# Altium project FIT_PM12.PrjPcb (part 7 of 13)

## Sheet THS788_2.SchDoc: FIT_PM12 board
size 420 x 297 mm; CheckedBy: G.Kasprowicz; Author: INR Moscow; CompanyName: WUT ISE; DrawnBy: M.Podgórski; Organization: WUT ISE; Address1: PW ISE; Address2: Nowowiejska 15/19 00-665 Warsaw; Address3: gkasprow@gmail.com; DocumentNumber: 23; Revision: 2; SheetNumber: 34; SheetTotal: 34; ModifiedBy: -; CheckedDate: -; Title2: TDC2; DivGrp: WUT ISE; Designer: INR RAS; ModifiedDate: -; ProjectName: Sensor Box
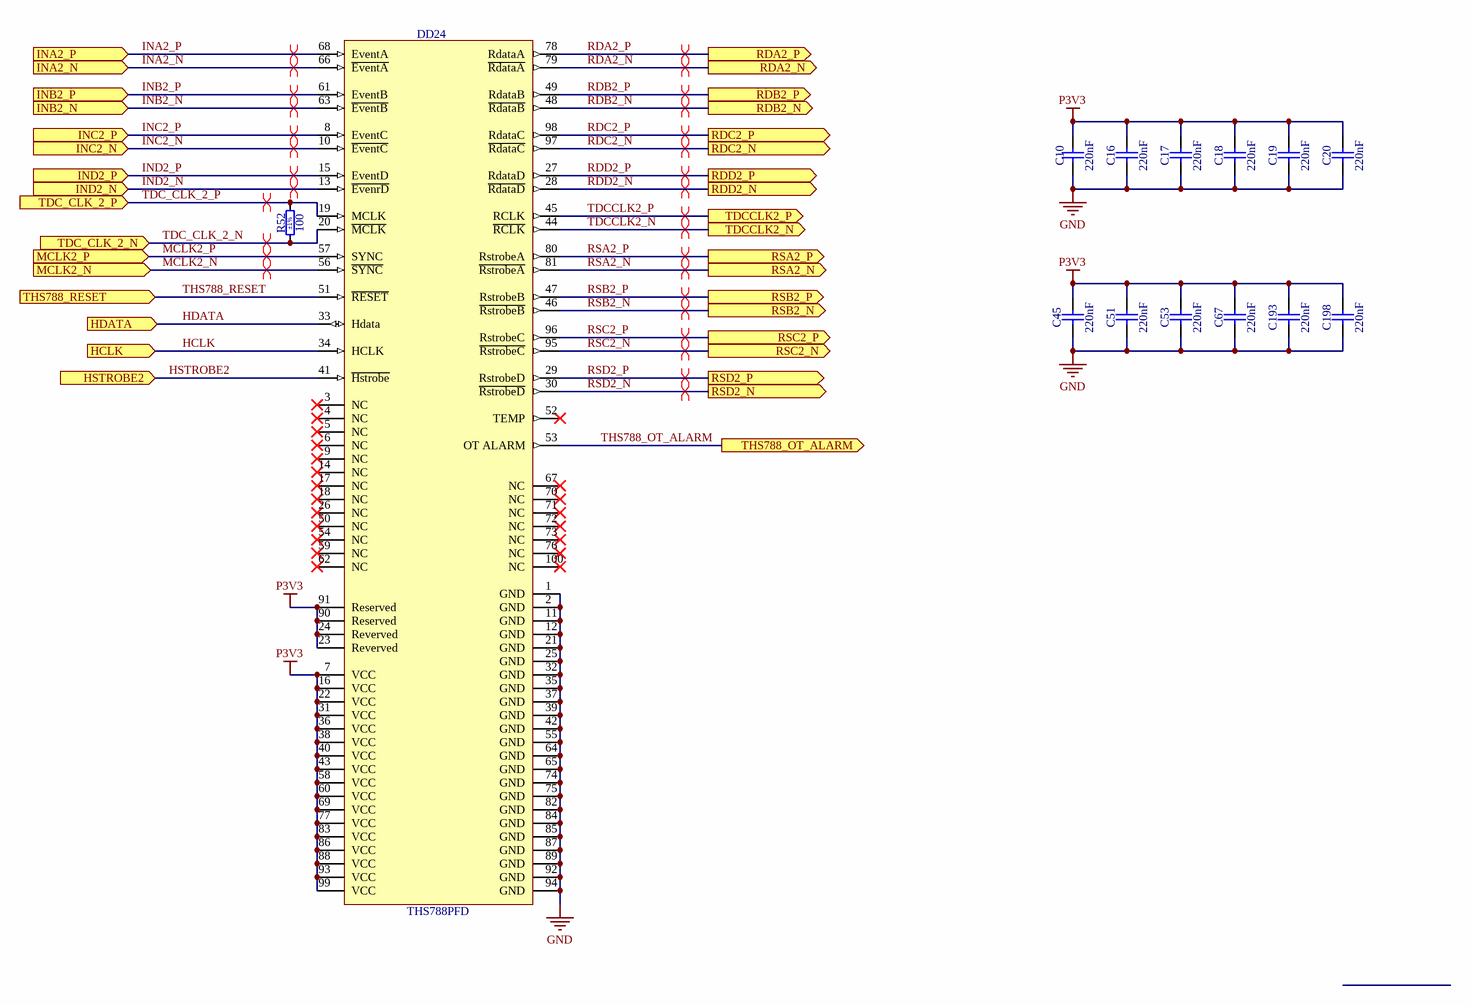
[diagram p21: THS788_2.SchDoc]

### Parts
C10  220nF  [CAPC2012X135N]
C16  220nF  [CAPC2012X135N]
C17  220nF  [CAPC2012X135N]
C18  220nF  [CAPC2012X135N]
C19  220nF  [CAPC2012X135N]
C20  220nF  [CAPC2012X135N]
C45  220nF  [CAPC2012X135N]
C51  220nF  [CAPC2012X135N]
C53  220nF  [CAPC2012X135N]
C67  220nF  [CAPC2012X135N]
C193  220nF  [CAPC2012X135N]
C198  220nF  [CAPC2012X135N]
DD24  THS788PFD  [TEXAS_PFD (S-PQFP-G100)]
R52  100  Tolerance: ±1%  [RESC1608X55N]

### Ports
HCLK (in), HDATA (in), HSTROBE2 (in), INA2_N (in), INA2_P (in), INB2_N (in), INB2_P (in), INC2_N (in), INC2_P (in), IND2_N (in), IND2_P (in), MCLK2_N (in), MCLK2_P (in), RDA2_N (out), RDA2_P (out), RDB2_N (out), RDB2_P (out), RDC2_N (out), RDC2_P (out), RDD2_N (out), RDD2_P (out), RSA2_N (out), RSA2_P (out), RSB2_N (out), RSB2_P (out), RSC2_N (out), RSC2_P (out), RSD2_N (out), RSD2_P (out), TDC_CLK_2_N (in), TDC_CLK_2_P (in), TDCCLK2_N (out), TDCCLK2_P (out), THS788_OT_ALARM (out), THS788_RESET (in)

### Nets
GND: C10.1 C16.1 C17.1 C18.1 C19.1 C20.1 C45.1 C51.1 C53.1 C67.1 C193.1 C198.1 DD24.1(GND) DD24.2(GND) DD24.11(GND) DD24.12(GND) DD24.21(GND) DD24.25(GND) DD24.32(GND) DD24.35(GND) DD24.37(GND) DD24.39(GND) DD24.42(GND) DD24.55(GND) DD24.64(GND) DD24.65(GND) DD24.74(GND) DD24.75(GND) DD24.82(GND) DD24.84(GND) DD24.85(GND) DD24.87(GND) DD24.89(GND) DD24.92(GND) DD24.94(GND)
P3V3: C10.2 C16.2 C17.2 C18.2 C19.2 C20.2 C45.2 C51.2 C53.2 C67.2 C193.2 C198.2 DD24.7(VCC) DD24.16(VCC) DD24.22(VCC) DD24.23(Reverved) DD24.24(Reverved) DD24.31(VCC) DD24.36(VCC) DD24.38(VCC) DD24.40(VCC) DD24.43(VCC) DD24.58(VCC) DD24.60(VCC) DD24.69(VCC) DD24.77(VCC) DD24.83(VCC) DD24.86(VCC) DD24.88(VCC) DD24.90(Reserved) DD24.91(Reserved) DD24.93(VCC) DD24.99(VCC)
HCLK: DD24.34(HCLK) ; port HCLK
HDATA: DD24.33(Hdata) ; port HDATA
HSTROBE2: DD24.41(~{Hstrobe}) ; port HSTROBE2
INA2_N: DD24.66(~{EventA}) ; port INA2_N  [project net Event_N]
INA2_P: DD24.68(EventA) ; port INA2_P  [project net Event_P]
INB2_N: DD24.63(~{EventB}) ; port INB2_N  [project net Event_N]
INB2_P: DD24.61(EventB) ; port INB2_P  [project net Event_P]
INC2_N: DD24.10(~{EventC}) ; port INC2_N  [project net Event_N]
INC2_P: DD24.8(EventC) ; port INC2_P  [project net Event_P]
IND2_N: DD24.13(~{EvenrD}) ; port IND2_N  [project net Event_N]
IND2_P: DD24.15(EventD) ; port IND2_P  [project net Event_P]
MCLK2_N: DD24.56(~{SYNC}) ; port MCLK2_N
MCLK2_P: DD24.57(SYNC) ; port MCLK2_P
RDA2_N: DD24.79(~{RdataA}) ; port RDA2_N
RDA2_P: DD24.78(RdataA) ; port RDA2_P
RDB2_N: DD24.48(~{RdataB}) ; port RDB2_N
RDB2_P: DD24.49(RdataB) ; port RDB2_P
RDC2_N: DD24.97(~{RdataC}) ; port RDC2_N
RDC2_P: DD24.98(RdataC) ; port RDC2_P
RDD2_N: DD24.28(~{RdataD}) ; port RDD2_N
RDD2_P: DD24.27(RdataD) ; port RDD2_P
RSA2_N: DD24.81(~{RstrobeA}) ; port RSA2_N
RSA2_P: DD24.80(RstrobeA) ; port RSA2_P
RSB2_N: DD24.46(~{RstrobeB}) ; port RSB2_N
RSB2_P: DD24.47(RstrobeB) ; port RSB2_P
RSC2_N: DD24.95(~{RstrobeC}) ; port RSC2_N
RSC2_P: DD24.96(RstrobeC) ; port RSC2_P
RSD2_N: DD24.30(~{RstrobeD}) ; port RSD2_N
RSD2_P: DD24.29(RstrobeD) ; port RSD2_P
TDC_CLK_2_N: DD24.20(~{MCLK}) R52.1 ; port TDC_CLK_2_N
TDC_CLK_2_P: DD24.19(MCLK) R52.2 ; port TDC_CLK_2_P
TDCCLK2_N: DD24.44(~{RCLK}) ; port TDCCLK2_N
TDCCLK2_P: DD24.45(RCLK) ; port TDCCLK2_P
THS788_OT_ALARM: DD24.53(OT_ALARM) ; port THS788_OT_ALARM
THS788_RESET: DD24.51(~{RESET}) ; port THS788_RESET

Not connected (* = marked no-connect by the designer): DD24 3(NC)* 4(NC)* 5(NC)* 6(NC)* 9(NC)* 14(NC)* 17(NC)* 18(NC)* 26(NC)* 50(NC)* 52(TEMP)* 54(NC)* 59(NC)* 62(NC)* 67(NC)* 70(NC)* 71(NC)* 72(NC)* 73(NC)* 76(NC)* 100(NC)*

### Layout directives
differential pair: Event_N, Event_P, MCLK2_N, MCLK2_P, RDA2_N, RDA2_P, RDB2_N, RDB2_P, RDC2_N, RDC2_P, RDD2_N, RDD2_P, RSA2_N, RSA2_P, RSB2_N, RSB2_P, RSC2_N, RSC2_P, RSD2_N, RSD2_P, TDC_CLK_2_N, TDC_CLK_2_P, TDCCLK2_N, TDCCLK2_P

### Notes on the sheet
- Project/Equipment
- Document
- Designer
- Drawn by
- Check.by
- Copyright WUT ISE 2024.
  This documentation describes Open Hardware and is licensed under the CERN OHL v.2. You may redistribute and modify this documentation under the terms of the CERN OHL v.2. (http://ohwr.org/CERNOHL). This documentation is distributed WITHOUT ANY EXPRESS OR IMPLIED WARRANTY, INCLUDING OF MERCHANTABILITY, SATISFACTORY QUALITY AND FITNESS FOR A PARTICULAR PURPOSE. Please see the CERN OHL v.2 for applicable conditions.
- Contact
- File
- Last Mod.
- Print Date
- Sheet
- Size
- A3
- of
- Rev

### Library data of the parts
C10 C16-C20 C45 C51 C53 C67 C193 C198 = CC0805_220NF_50V_10%_X7R: as C21 on sheet THS788_1; Part Number: CC0805_220NF_50V_10%_X7R; Component Kind: Standard; Component Type: Standard; Pin Count: 2; Value: 220nF; Status: Preferred; Manufacturer Part Number: CC0805_220NF_50V_10%_X7R; Case: 0805; Mounted: Yes; Socket: No; SMD: Yes; Sense: No; Manufacturer1 Example: MURATA; Manufacturer1 ComponentHeight: 1.35mm; HelpURL: \\cern.ch\dfs\Applications\Altium\Datasheets\CC0805_X7R_MURATA.pdf; Author: CERN DEM JLC; CreateDate: 03.12.2007; LatestRevisionDate: 03.12.2007
DD24 = THS788PFD: as DD4 on sheet THS788_1; Part Number: THS788PFD; Component Kind: Standard; Component Type: Standard; Device: THS788PFD; Footprint: TEXAS_2PFD (S-PQFP-G100); PackageDescription: QFP, 0.50mm Pitch, Square; 100 Pin, 14.0mm L X 14.0mm W X 1.20mm H body (w/Thermal Tab 6.0 X 6.0mm), IPC Medium Density; Status: Not Recommended; Part Description: Quad-Channel Time Measurement Unit (TMU); Manufacturer Part Number: THS788PFD; Pin Count: 101; Case: QFP100; Mounted: Yes; Socket: No; SMD: Yes; Sense: No; ComponentHeight: 1.2mm; Author: CERN DEM HF; HelpURL: \\cern.ch\dfs\Applications\Altium\Datasheets\THS788.pdf; CreateDate: 10.06.2024; LatestRevisionDate: 10.06.2024
R52 = R0603_100R_1%_0.1W_100PPM: as R32 on sheet THS788_1; Part Number: R0603_100R_1%_0.1W_100PPM; Component Kind: Standard; Component Type: Standard; Pin Count: 2; Value: 100; Status: Preferred; Manufacturer Part Number: R0603_100R_1%_0.1W_100PPM; Case: 0603; Mounted: Yes; Sense: No; Socket: No; SMD: Yes; Manufacturer1 Example: NIC COMPONENT; Manufacturer1 ComponentHeight: 0.55mm; HelpURL: \\cern.ch\dfs\Applications\Altium\Datasheets\R0603_2NIC_2NRC.pdf; Author: CERN DEM JLC; CreateDate: 03.12.2007; LatestRevisionDate: 13.03.2008

## Sheet FPGA_I_J.SchDoc: FIT_PM12 board
size 420 x 297 mm; CheckedBy: G.Kasprowicz; Author: INR Moscow; CompanyName: WUT ISE; DrawnBy: M.Podgórski; Organization: WUT ISE; Address1: PW ISE; Address2: Nowowiejska 15/19 00-665 Warsaw; Address3: gkasprow@gmail.com; DocumentNumber: 32; Revision: 2; SheetNumber: 32; SheetTotal: 34; ModifiedBy: -; CheckedDate: -; Title2: FPGA JTAG MGTs; DivGrp: WUT ISE; Designer: INR RAS; ModifiedDate: -; ProjectName: Sensor Box
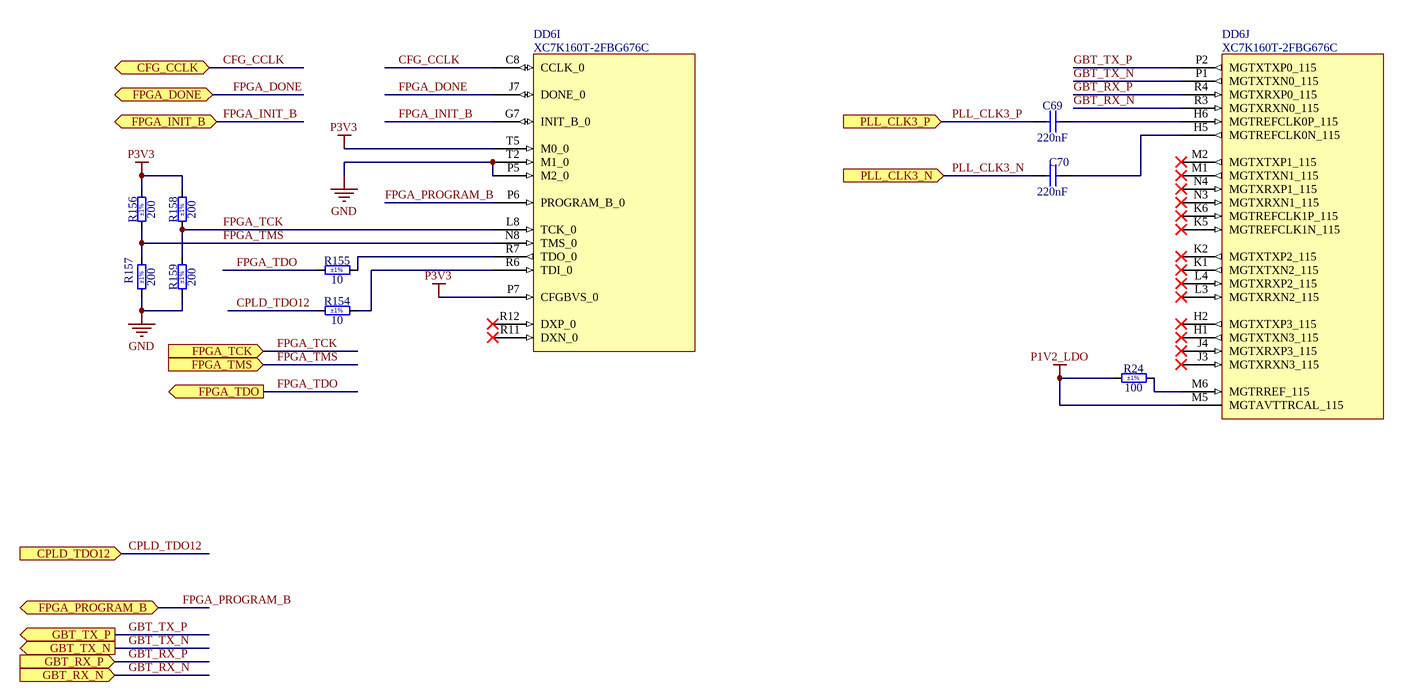
[diagram p22: FPGA_I_J.SchDoc]

### Parts
C69  220nF  [CAPC1608X87N]
C70  220nF  [CAPC1608X87N]
DD6  XC7K160T-2FBG676C  [BGA676C100P26X26_2700X2700X254]  (parts I,J of 15)
R24  100  Tolerance: ±1%  [RESC1608X55N]
R154  10  Tolerance: ±1%  [RESC2012X70N]
R155  10  Tolerance: ±1%  [RESC2012X70N]
R156  200  Tolerance: ±1%  [RESC2012X60N]
R157  200  Tolerance: ±1%  [RESC2012X60N]
R158  200  Tolerance: ±1%  [RESC2012X60N]
R159  200  Tolerance: ±1%  [RESC2012X60N]

### Ports
CFG_CCLK (bidir), CPLD_TDO12 (in), FPGA_DONE (bidir), FPGA_INIT_B (bidir), FPGA_PROGRAM_B (bidir), FPGA_TCK (in), FPGA_TDO (out), FPGA_TMS (in), GBT_RX_N (in), GBT_RX_P (in), GBT_TX_N (out), GBT_TX_P (out), PLL_CLK3_N (in), PLL_CLK3_P (in)

### Nets
GND: DD6.P5(M2_0) DD6.T2(M1_0) R157.1 R159.1
P1V2_LDO: DD6.M5(MGTAVTTRCAL_115) R24.1
P3V3: DD6.P7(CFGBVS_0) DD6.T5(M0_0) R156.2 R158.2
CFG_CCLK: DD6.C8(CCLK_0) ; port CFG_CCLK
CPLD_TDO12: R154.1 ; port CPLD_TDO12  [project net CPLD_TDO]
FPGA_DONE: DD6.J7(DONE_0) ; port FPGA_DONE
FPGA_INIT_B: DD6.G7(INIT_B_0) ; port FPGA_INIT_B
FPGA_PROGRAM_B: DD6.P6(PROGRAM_B_0) ; port FPGA_PROGRAM_B
FPGA_TCK: DD6.L8(TCK_0) R158.1 R159.2 ; port FPGA_TCK
FPGA_TDO: R155.1 ; port FPGA_TDO
FPGA_TMS: DD6.N8(TMS_0) R156.1 R157.2 ; port FPGA_TMS
GBT_RX_N: DD6.R3(MGTXRXN0_115) ; port GBT_RX_N
GBT_RX_P: DD6.R4(MGTXRXP0_115) ; port GBT_RX_P
GBT_TX_N: DD6.P1(MGTXTXN0_115) ; port GBT_TX_N
GBT_TX_P: DD6.P2(MGTXTXP0_115) ; port GBT_TX_P
PLL_CLK3_N: C70.1 ; port PLL_CLK3_N
PLL_CLK3_P: C69.1 ; port PLL_CLK3_P
NetC69_2: C69.2 DD6.H6(MGTREFCLK0P_115)
NetC70_2: C70.2 DD6.H5(MGTREFCLK0N_115)
NetDD6_M6: DD6.M6(MGTRREF_115) R24.2
NetDD6_R6: DD6.R6(TDI_0) R154.2
NetDD6_R7: DD6.R7(TDO_0) R155.2

Not connected (* = marked no-connect by the designer): DD6 H1(MGTXTXN3_115)* H2(MGTXTXP3_115)* J3(MGTXRXN3_115)* J4(MGTXRXP3_115)* K1(MGTXTXN2_115)* K2(MGTXTXP2_115)* K5(MGTREFCLK1N_115)* K6(MGTREFCLK1P_115)* L3(MGTXRXN2_115)* L4(MGTXRXP2_115)* M1(MGTXTXN1_115)* M2(MGTXTXP1_115)* N3(MGTXRXN1_115)* N4(MGTXRXP1_115)* R11(DXN_0)* R12(DXP_0)*

### Notes on the sheet
- Project/Equipment
- Document
- Designer
- Drawn by
- Check.by
- Copyright WUT ISE 2024.
  This documentation describes Open Hardware and is licensed under the CERN OHL v.2. You may redistribute and modify this documentation under the terms of the CERN OHL v.2. (http://ohwr.org/CERNOHL). This documentation is distributed WITHOUT ANY EXPRESS OR IMPLIED WARRANTY, INCLUDING OF MERCHANTABILITY, SATISFACTORY QUALITY AND FITNESS FOR A PARTICULAR PURPOSE. Please see the CERN OHL v.2 for applicable conditions.
- Contact
- File
- Last Mod.
- Print Date
- Sheet
- Size
- A3
- of
- Rev

### Library data of the parts
C69 C70 = CC0603_220NF_25V_10%_X7R: Non-polarised capacitor; Part Description: SMD Multilayer Chip Ceramic Capacitor; Manufacturer: GENERIC; Manufacturer1 Part Number: C0603C224K3RACTU; Voltage: 25V; TC: X7R; Tolerance: ±10%; Part Number: CC0603_220NF_25V_10%_X7R; Component Kind: Standard; Component Type: Standard; Pin Count: 2; Value: 220nF; Status: Preferred; Manufacturer Part Number: CC0603_220NF_25V_10%_X7R; Case: 0603; Mounted: Yes; Socket: No; SMD: Yes; Sense: No; Manufacturer1 Example: KEMET; Manufacturer1 ComponentHeight: 0.87mm; HelpURL: \\cern.ch\dfs\Applications\Altium\Datasheets\CC0603_X7R_KEMET.pdf; Author: CERN DEM JLC; CreateDate: 29.10.2014; LatestRevisionDate: 29.10.2014
DD6 = XC7K160T-2FBG676C: as DD6 on sheet FPGA_H; Part Number: XC7K160T-2FBG676C; Component Kind: Standard; Component Type: Standard; Device: XC7K160T-2FBG676C; PackageDescription: BGA, 1.00mm Pitch, Square; 676 Pin, 26 Columns X 26 Rows, Body 27.0mm X 27.0mm X 2.54mm H, IPC Medium Density; Manufacturer Part Number: XC7K160T-2FBG676C; Pin Count: 676; Case: BGA676; Mounted: Yes; Socket: No; SMD: Yes; Sense: No; ComponentHeight: 2.54mm; HelpURL: \\cern.ch\dfs\Applications\Altium\Datasheets\XC7K160T-xFBG676C.pdf; ComponentLink1URL: \\cern.ch\dfs\Applications\Altium\Datasheets\XC7K160T-xFBG676C_Package-Pinout.pdf; ComponentLink1Description: Package/Pinout; Author: CERN DEM BC; CreateDate: 06.02.2020; LatestRevisionDate: 06.02.2020
R24 = R0603_100R_1%_0.1W_100PPM: as R32 on sheet THS788_1; Part Number: R0603_100R_1%_0.1W_100PPM; Component Kind: Standard; Component Type: Standard; Pin Count: 2; Value: 100; Status: Preferred; Manufacturer Part Number: R0603_100R_1%_0.1W_100PPM; Case: 0603; Mounted: Yes; Sense: No; Socket: No; SMD: Yes; Manufacturer1 Example: NIC COMPONENT; Manufacturer1 ComponentHeight: 0.55mm; HelpURL: \\cern.ch\dfs\Applications\Altium\Datasheets\R0603_NIC_NRC.pdf; Author: CERN DEM JLC; CreateDate: 03.12.2007; LatestRevisionDate: 13.03.2008
R154 R155 = R0805_10R_1%_0.125W_100PPM_PANASONIC_ERJ: Resistor - 1%; Part Description: Low Resistance Thick Film Chip Resistor; Manufacturer Part Number: ERJ6ENF10R0V; Power: 0.125W; TC: ±100ppm/°C; PressFit: No; Part Number: R0805_10R_1%_0.125W_100PPM_PANASONIC_ERJ; Component Kind: Standard; Component Type: Standard; Pin Count: 2; Value: 10; Status: None; Manufacturer: PANASONIC; Case: 0805; Mounted: Yes; Sense: No; Socket: No; SMD: Yes; ComponentHeight: 0.7mm; HelpURL: \\cern.ch\dfs\Applications\Altium\Datasheets\R0805_PANASONIC_ERJ6EN.pdf; Author: CERN DEM HF; CreateDate: 07.06.2024; LatestRevisionDate: 07.06.2024
R156-R159 = R0805_200R_1%_0.125W_100PPM: Resistor - 1%; Part Description: General Purpose Thick Film Chip Resistor; Manufacturer: GENERIC; Manufacturer1 Part Number: NRC10F2000TRF; Power: 0.125W; TC: ±100ppm/°C; PressFit: No; Part Number: R0805_200R_1%_0.125W_100PPM; Component Kind: Standard; Component Type: Standard; Pin Count: 2; Value: 200; Status: Preferred; Manufacturer Part Number: R0805_200R_1%_0.125W_100PPM; Case: 0805; Mounted: Yes; Sense: No; Socket: No; SMD: Yes; Manufacturer1 Example: NIC COMPONENT; Manufacturer1 ComponentHeight: 0.6mm; HelpURL: \\cern.ch\dfs\Applications\Altium\Datasheets\R0805_NIC_NRC.pdf; Author: CERN DEM JLC; CreateDate: 03.12.2007; LatestRevisionDate: 13.03.2008

## Sheet FPGA_E.SchDoc: FIT_PM12 board
size 420 x 297 mm; CheckedBy: G.Kasprowicz; Author: INR Moscow; CompanyName: WUT ISE; DrawnBy: M.Podgórski; Organization: WUT ISE; Address1: PW ISE; Address2: Nowowiejska 15/19 00-665 Warsaw; Address3: gkasprow@gmail.com; DocumentNumber: 27; Revision: 2; SheetNumber: 25; SheetTotal: 34; ModifiedBy: -; CheckedDate: -; Title2: FPGA E LA0,1,2; DivGrp: WUT ISE; Designer: INR RAS; ModifiedDate: -; ProjectName: Sensor Box
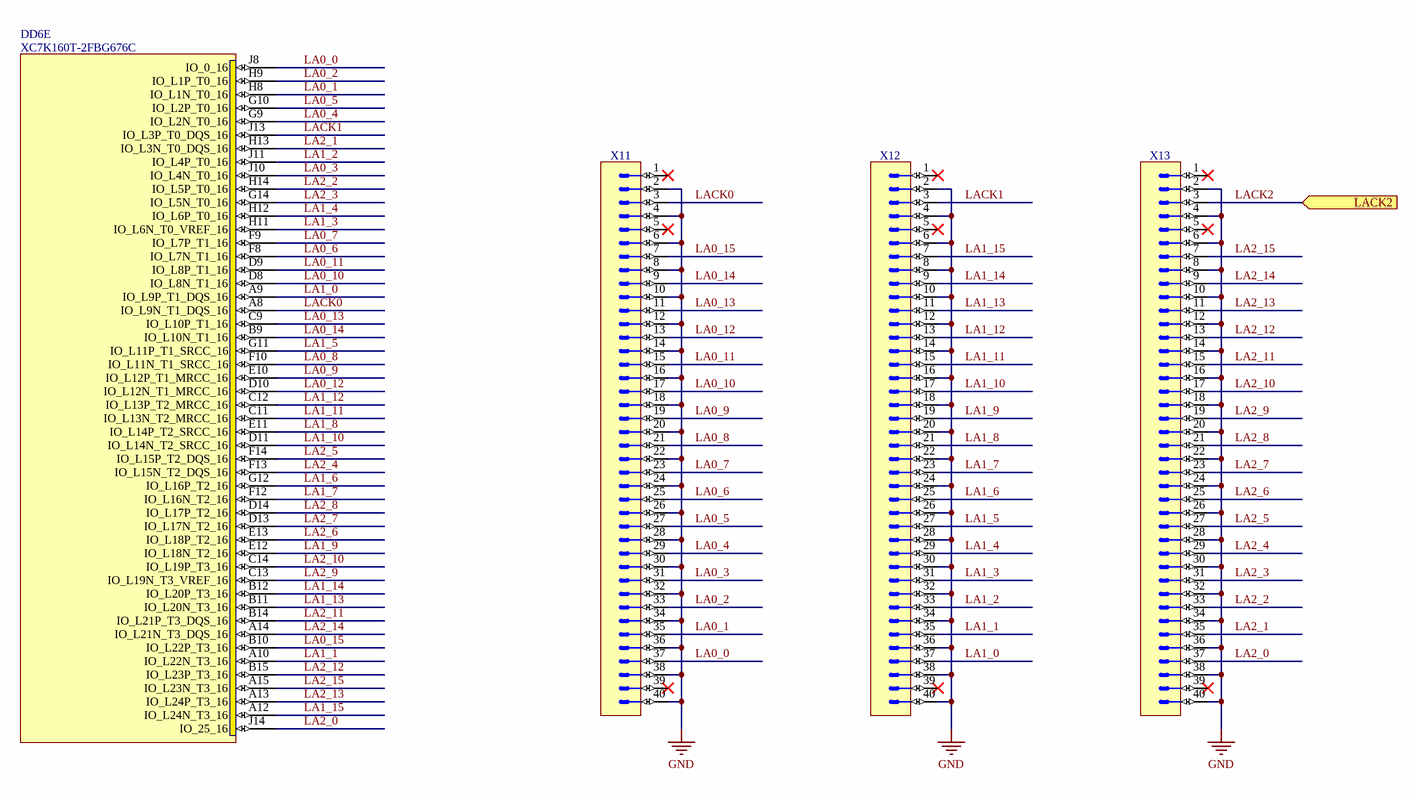
[diagram p23: FPGA_E.SchDoc]

### Parts
DD6  XC7K160T-2FBG676C  [BGA676C100P26X26_2700X2700X254]  (part E of 15)
X11  (no value)  [CONNFLY_DS1013-40SSIB1-B-0]
X12  (no value)  [CONNFLY_DS1013-40SSIB1-B-0]
X13  (no value)  [CONNFLY_DS1013-40SSIB1-B-0]

### Ports
LACK2 (in)

### Nets
GND: X11.2 X11.4 X11.6 X11.8 X11.10 X11.12 X11.14 X11.16 X11.18 X11.20 X11.22 X11.24 X11.26 X11.28 X11.30 X11.32 X11.34 X11.36 X11.38 X11.40 X12.2 X12.4 X12.6 X12.8 X12.10 X12.12 X12.14 X12.16 X12.18 X12.20 X12.22 X12.24 X12.26 X12.28 X12.30 X12.32 X12.34 X12.36 X12.38 X12.40 X13.2 X13.4 X13.6 X13.8 X13.10 X13.12 X13.14 X13.16 X13.18 X13.20 X13.22 X13.24 X13.26 X13.28 X13.30 X13.32 X13.34 X13.36 X13.38 X13.40
LA0_0: DD6.J8(IO_0_16) X11.37
LA0_1: DD6.H8(IO_L1N_T0_16) X11.35
LA0_2: DD6.H9(IO_L1P_T0_16) X11.33
LA0_3: DD6.J10(IO_L4N_T0_16) X11.31
LA0_4: DD6.G9(IO_L2N_T0_16) X11.29
LA0_5: DD6.G10(IO_L2P_T0_16) X11.27
LA0_6: DD6.F8(IO_L7N_T1_16) X11.25
LA0_7: DD6.F9(IO_L7P_T1_16) X11.23
LA0_8: DD6.F10(IO_L11N_T1_SRCC_16) X11.21
LA0_9: DD6.E10(IO_L12P_T1_MRCC_16) X11.19
LA0_10: DD6.D8(IO_L8N_T1_16) X11.17
LA0_11: DD6.D9(IO_L8P_T1_16) X11.15
LA0_12: DD6.D10(IO_L12N_T1_MRCC_16) X11.13
LA0_13: DD6.C9(IO_L10P_T1_16) X11.11
LA0_14: DD6.B9(IO_L10N_T1_16) X11.9
LA0_15: DD6.B10(IO_L22P_T3_16) X11.7
LA1_0: DD6.A9(IO_L9P_T1_DQS_16) X12.37
LA1_1: DD6.A10(IO_L22N_T3_16) X12.35
LA1_2: DD6.J11(IO_L4P_T0_16) X12.33
LA1_3: DD6.H11(IO_L6N_T0_VREF_16) X12.31
LA1_4: DD6.H12(IO_L6P_T0_16) X12.29
LA1_5: DD6.G11(IO_L11P_T1_SRCC_16) X12.27
LA1_6: DD6.G12(IO_L16P_T2_16) X12.25
LA1_7: DD6.F12(IO_L16N_T2_16) X12.23
LA1_8: DD6.E11(IO_L14P_T2_SRCC_16) X12.21
LA1_9: DD6.E12(IO_L18N_T2_16) X12.19
LA1_10: DD6.D11(IO_L14N_T2_SRCC_16) X12.17
LA1_11: DD6.C11(IO_L13N_T2_MRCC_16) X12.15
LA1_12: DD6.C12(IO_L13P_T2_MRCC_16) X12.13
LA1_13: DD6.B11(IO_L20N_T3_16) X12.11
LA1_14: DD6.B12(IO_L20P_T3_16) X12.9
LA1_15: DD6.A12(IO_L24N_T3_16) X12.7
LA2_0: DD6.J14(IO_25_16) X13.37
LA2_1: DD6.H13(IO_L3N_T0_DQS_16) X13.35
LA2_2: DD6.H14(IO_L5P_T0_16) X13.33
LA2_3: DD6.G14(IO_L5N_T0_16) X13.31
LA2_4: DD6.F13(IO_L15N_T2_DQS_16) X13.29
LA2_5: DD6.F14(IO_L15P_T2_DQS_16) X13.27
LA2_6: DD6.E13(IO_L18P_T2_16) X13.25
LA2_7: DD6.D13(IO_L17N_T2_16) X13.23
LA2_8: DD6.D14(IO_L17P_T2_16) X13.21
LA2_9: DD6.C13(IO_L19N_T3_VREF_16) X13.19
LA2_10: DD6.C14(IO_L19P_T3_16) X13.17
LA2_11: DD6.B14(IO_L21P_T3_DQS_16) X13.15
LA2_12: DD6.B15(IO_L23P_T3_16) X13.13
LA2_13: DD6.A13(IO_L24P_T3_16) X13.11
LA2_14: DD6.A14(IO_L21N_T3_DQS_16) X13.9
LA2_15: DD6.A15(IO_L23N_T3_16) X13.7
LACK0: DD6.A8(IO_L9N_T1_DQS_16) X11.3
LACK1: DD6.J13(IO_L3P_T0_DQS_16) X12.3
LACK2: X13.3 ; port LACK2

Not connected (* = marked no-connect by the designer): X11 1* 5* 39*; X12 1* 5* 39*; X13 1* 5* 39*

### Notes on the sheet
- Project/Equipment
- Document
- Designer
- Drawn by
- Check.by
- Copyright WUT ISE 2024.
  This documentation describes Open Hardware and is licensed under the CERN OHL v.2. You may redistribute and modify this documentation under the terms of the CERN OHL v.2. (http://ohwr.org/CERNOHL). This documentation is distributed WITHOUT ANY EXPRESS OR IMPLIED WARRANTY, INCLUDING OF MERCHANTABILITY, SATISFACTORY QUALITY AND FITNESS FOR A PARTICULAR PURPOSE. Please see the CERN OHL v.2 for applicable conditions.
- Contact
- File
- Last Mod.
- Print Date
- Sheet
- Size
- A3
- of
- Rev

### Library data of the parts
DD6 = XC7K160T-2FBG676C: as DD6 on sheet FPGA_H; Part Number: XC7K160T-2FBG676C; Component Kind: Standard; Component Type: Standard; Device: XC7K160T-2FBG676C; PackageDescription: BGA, 1.00mm Pitch, Square; 676 Pin, 26 Columns X 26 Rows, Body 27.0mm X 27.0mm X 2.54mm H, IPC Medium Density; Manufacturer Part Number: XC7K160T-2FBG676C; Pin Count: 676; Case: BGA676; Mounted: Yes; Socket: No; SMD: Yes; Sense: No; ComponentHeight: 2.54mm; HelpURL: \\cern.ch\dfs\Applications\Altium\Datasheets\XC7K160T-xFBG676C.pdf; ComponentLink1URL: \\cern.ch\dfs\Applications\Altium\Datasheets\XC7K160T-xFBG676C_Package-Pinout.pdf; ComponentLink1Description: Package/Pinout; Author: CERN DEM BC; CreateDate: 06.02.2020; LatestRevisionDate: 06.02.2020
X11-X13 = CONNFLY_DS1013-40SSIB1-B-0: Connector 40 Male; Part Description: 40 Contacts, 2.54mm Box Header V/T,R/A & SMT Type; PressFit: No; Part Number: CONNFLY_DS1013-40SSIB1-B-0; Component Kind: Standard; Component Type: Standard; Pin Count: 40; Mounted: Yes; Socket: No; SMD: No; Sense: No; Status: None; Manufacturer: CONNFLY; Manufacturer Part Number: DS1013-40SSIB1-B-0; ComponentHeight: 9.1mm; HelpURL: \\cern.ch\dfs\Applications\Altium\Datasheets\CONNFLY_DS1013.pdf; Author: CERN DEM HF; CreateDate: 30.05.2024; LatestRevisionDate: 30.05.2024

## Sheet FPGA_C.SchDoc: FIT_PM12 board
size 420 x 297 mm; CheckedBy: G.Kasprowicz; Author: INR Moscow; CompanyName: WUT ISE; DrawnBy: M.Podgórski; Organization: WUT ISE; Address1: PW ISE; Address2: Nowowiejska 15/19 00-665 Warsaw; Address3: gkasprow@gmail.com; DocumentNumber: 28; Revision: 2; SheetNumber: 26; SheetTotal: 34; ModifiedBy: -; CheckedDate: -; Title2: FPGA C LA3; DivGrp: WUT ISE; Designer: INR RAS; ModifiedDate: -; ProjectName: Sensor Box
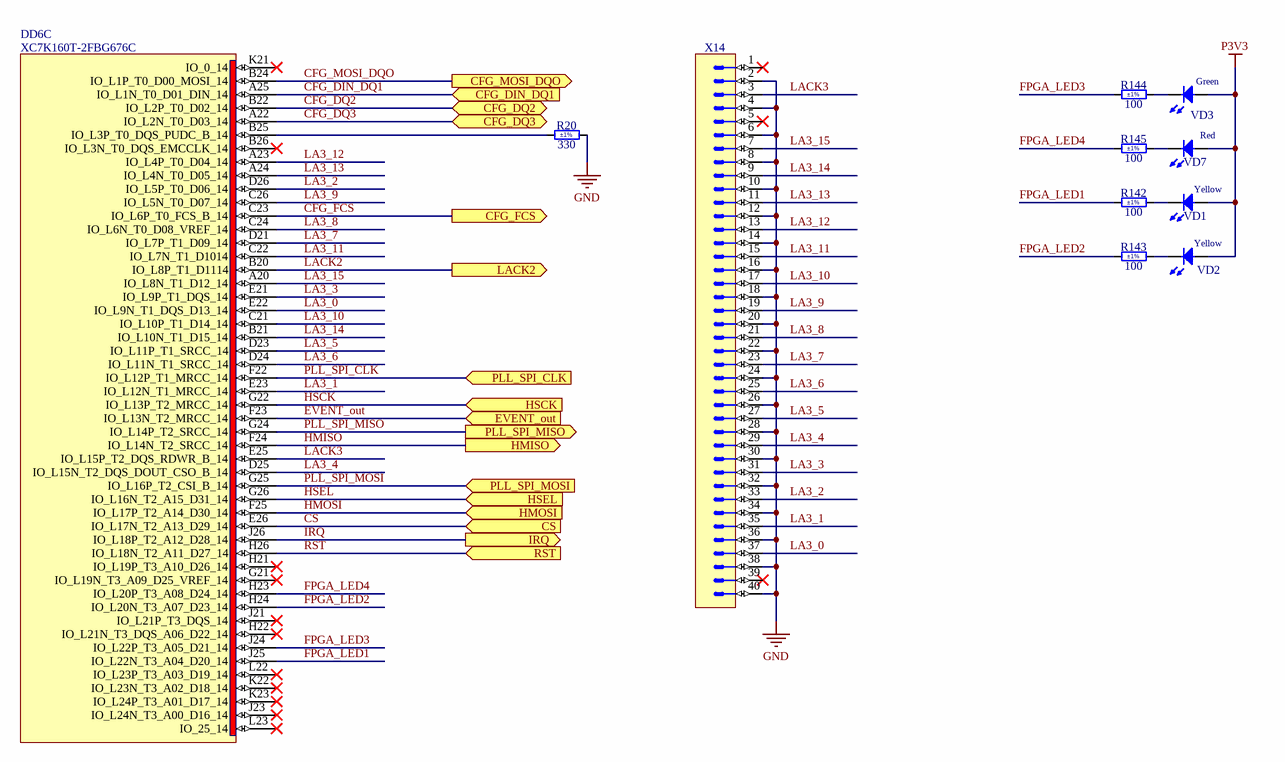
[diagram p24: FPGA_C.SchDoc]

### Parts
DD6  XC7K160T-2FBG676C  [BGA676C100P26X26_2700X2700X254]  (part C of 15)
R20  330  Tolerance: ±1%  [RESC2012X60N]
R142  100  Tolerance: ±1%  [RESC2012X60N]
R143  100  Tolerance: ±1%  [RESC2012X60N]
R144  100  Tolerance: ±1%  [RESC2012X60N]
R145  100  Tolerance: ±1%  [RESC2012X60N]
VD1  Yellow  [LED_KINGBRIGHT_KPT-2012YC]
VD2  Yellow  [LED_KINGBRIGHT_KPT-2012YC]
VD3  Green  [LED_KINGBRIGHT_KP-2012LSGC]
VD7  Red  [LED_KINGBRIGHT_KPT-2012SURCK]
X14  (no value)  [CONNFLY_DS1013-40SSIB1-B-0]

### Ports
CFG_DIN_DQ1 (in), CFG_DQ2 (bidir), CFG_DQ3 (bidir), CFG_FCS (out), CFG_MOSI_DQO (out), CS (in), EVENT_out (in), HMISO (out), HMOSI (in), HSCK (in), HSEL (in), IRQ (out), LACK2 (out), PLL_SPI_CLK (in), PLL_SPI_MISO (out), PLL_SPI_MOSI (in), RST (in)

### Nets
GND: R20.2 X14.2 X14.4 X14.6 X14.8 X14.10 X14.12 X14.14 X14.16 X14.18 X14.20 X14.22 X14.24 X14.26 X14.28 X14.30 X14.32 X14.34 X14.36 X14.38 X14.40
P3V3: VD1.2(A) VD2.2(A) VD3.2(A) VD7.2(A)
CFG_DIN_DQ1: DD6.A25(IO_L1N_T0_D01_DIN_14) ; port CFG_DIN_DQ1
CFG_DQ2: DD6.B22(IO_L2P_T0_D02_14) ; port CFG_DQ2
CFG_DQ3: DD6.A22(IO_L2N_T0_D03_14) ; port CFG_DQ3
CFG_FCS: DD6.C23(IO_L6P_T0_FCS_B_14) ; port CFG_FCS
CFG_MOSI_DQO: DD6.B24(IO_L1P_T0_D00_MOSI_14) ; port CFG_MOSI_DQO
CS: DD6.E26(IO_L17N_T2_A13_D29_14) ; port CS
EVENT_out: DD6.F23(IO_L13N_T2_MRCC_14) ; port EVENT_out  [project net EV_IN_]
FPGA_LED1: DD6.J25(IO_L22N_T3_A04_D20_14) R142.1
FPGA_LED2: DD6.H24(IO_L20N_T3_A07_D23_14) R143.1
FPGA_LED3: DD6.J24(IO_L22P_T3_A05_D21_14) R144.1
FPGA_LED4: DD6.H23(IO_L20P_T3_A08_D24_14) R145.1
HMISO: DD6.F24(IO_L14N_T2_SRCC_14) ; port HMISO
HMOSI: DD6.F25(IO_L17P_T2_A14_D30_14) ; port HMOSI
HSCK: DD6.G22(IO_L13P_T2_MRCC_14) ; port HSCK
HSEL: DD6.G26(IO_L16N_T2_A15_D31_14) ; port HSEL
IRQ: DD6.J26(IO_L18P_T2_A12_D28_14) ; port IRQ
LA3_0: DD6.E22(IO_L9N_T1_DQS_D13_14) X14.37
LA3_1: DD6.E23(IO_L12N_T1_MRCC_14) X14.35
LA3_2: DD6.D26(IO_L5P_T0_D06_14) X14.33
LA3_3: DD6.E21(IO_L9P_T1_DQS_14) X14.31
LA3_4: DD6.D25(IO_L15N_T2_DQS_DOUT_CSO_B_14) X14.29
LA3_5: DD6.D23(IO_L11P_T1_SRCC_14) X14.27
LA3_6: DD6.D24(IO_L11N_T1_SRCC_14) X14.25
LA3_7: DD6.D21(IO_L7P_T1_D09_14) X14.23
LA3_8: DD6.C24(IO_L6N_T0_D08_VREF_14) X14.21
LA3_9: DD6.C26(IO_L5N_T0_D07_14) X14.19
LA3_10: DD6.C21(IO_L10P_T1_D14_14) X14.17
LA3_11: DD6.C22(IO_L7N_T1_D1014) X14.15
LA3_12: DD6.A23(IO_L4P_T0_D04_14) X14.13
LA3_13: DD6.A24(IO_L4N_T0_D05_14) X14.11
LA3_14: DD6.B21(IO_L10N_T1_D15_14) X14.9
LA3_15: DD6.A20(IO_L8N_T1_D12_14) X14.7
LACK2: DD6.B20(IO_L8P_T1_D1114) ; port LACK2
LACK3: DD6.E25(IO_L15P_T2_DQS_RDWR_B_14) X14.3
PLL_SPI_CLK: DD6.F22(IO_L12P_T1_MRCC_14) ; port PLL_SPI_CLK
PLL_SPI_MISO: DD6.G24(IO_L14P_T2_SRCC_14) ; port PLL_SPI_MISO
PLL_SPI_MOSI: DD6.G25(IO_L16P_T2_CSI_B_14) ; port PLL_SPI_MOSI
RST: DD6.H26(IO_L18N_T2_A11_D27_14) ; port RST
NetDD6_B25: DD6.B25(IO_L3P_T0_DQS_PUDC_B_14) R20.1
NetR142_2: R142.2 VD1.1(C)
NetR143_2: R143.2 VD2.1(C)
NetR144_2: R144.2 VD3.1(C)
NetR145_2: R145.2 VD7.1(C)

Not connected (* = marked no-connect by the designer): DD6 B26(IO_L3N_T0_DQS_EMCCLK_14)* G21(IO_L19N_T3_A09_D25_VREF_14)* H21(IO_L19P_T3_A10_D26_14)* H22(IO_L21N_T3_DQS_A06_D22_14)* J21(IO_L21P_T3_DQS_14)* J23(IO_L24N_T3_A00_D16_14)* K21(IO_0_14)* K22(IO_L23N_T3_A02_D18_14)* K23(IO_L24P_T3_A01_D17_14)* L22(IO_L23P_T3_A03_D19_14)* L23(IO_25_14)*; X14 1* 5* 39*

### Notes on the sheet
- Project/Equipment
- Document
- Designer
- Drawn by
- Check.by
- Copyright WUT ISE 2024.
  This documentation describes Open Hardware and is licensed under the CERN OHL v.2. You may redistribute and modify this documentation under the terms of the CERN OHL v.2. (http://ohwr.org/CERNOHL). This documentation is distributed WITHOUT ANY EXPRESS OR IMPLIED WARRANTY, INCLUDING OF MERCHANTABILITY, SATISFACTORY QUALITY AND FITNESS FOR A PARTICULAR PURPOSE. Please see the CERN OHL v.2 for applicable conditions.
- Contact
- File
- Last Mod.
- Print Date
- Sheet
- Size
- A3
- of
- Rev

### Library data of the parts
DD6 = XC7K160T-2FBG676C: as DD6 on sheet FPGA_H; Part Number: XC7K160T-2FBG676C; Component Kind: Standard; Component Type: Standard; Device: XC7K160T-2FBG676C; PackageDescription: BGA, 1.00mm Pitch, Square; 676 Pin, 26 Columns X 26 Rows, Body 27.0mm X 27.0mm X 2.54mm H, IPC Medium Density; Manufacturer Part Number: XC7K160T-2FBG676C; Pin Count: 676; Case: BGA676; Mounted: Yes; Socket: No; SMD: Yes; Sense: No; ComponentHeight: 2.54mm; HelpURL: \\cern.ch\dfs\Applications\Altium\Datasheets\XC7K160T-xFBG676C.pdf; ComponentLink1URL: \\cern.ch\dfs\Applications\Altium\Datasheets\XC7K160T-xFBG676C_Package-Pinout.pdf; ComponentLink1Description: Package/Pinout; Author: CERN DEM BC; CreateDate: 06.02.2020; LatestRevisionDate: 06.02.2020
R20 = R0805_330R_1%_0.125W_100PPM: Resistor - 1%; Part Description: General Purpose Thick Film Chip Resistor; Manufacturer: GENERIC; Manufacturer1 Part Number: NRC10F3300TRF; Power: 0.125W; TC: ±100ppm/°C; PressFit: No; Part Number: R0805_330R_1%_0.125W_100PPM; Component Kind: Standard; Component Type: Standard; Pin Count: 2; Value: 330; Status: Preferred; Manufacturer Part Number: R0805_330R_1%_0.125W_100PPM; Case: 0805; Mounted: Yes; Sense: No; Socket: No; SMD: Yes; Manufacturer1 Example: NIC COMPONENT; Manufacturer1 ComponentHeight: 0.6mm; HelpURL: \\cern.ch\dfs\Applications\Altium\Datasheets\R0805_NIC_NRC.pdf; Author: CERN DEM JLC; CreateDate: 03.12.2007; LatestRevisionDate: 13.03.2008
R142-R145 = R0805_100R_1%_0.125W_100PPM: Resistor - 1%; Part Description: General Purpose Thick Film Chip Resistor; Manufacturer: GENERIC; Manufacturer1 Part Number: NRC10F4700TRF; Power: 0.125W; TC: ±100ppm/°C; PressFit: No; Part Number: R0805_100R_1%_0.125W_100PPM; Component Kind: Standard; Component Type: Standard; Pin Count: 2; Value: 100; Status: Preferred; Manufacturer Part Number: R0805_100R_1%_0.125W_100PPM; Case: 0805; Mounted: Yes; Sense: No; Socket: No; SMD: Yes; Manufacturer1 Example: NIC COMPONENT; Manufacturer1 ComponentHeight: 0.6mm; HelpURL: \\cern.ch\dfs\Applications\Altium\Datasheets\R0805_NIC_NRC.pdf; Author: CERN DEM JLC; CreateDate: 03.12.2007; LatestRevisionDate: 13.03.2008
VD1 VD2 = LED_KINGBRIGHT_KPT-2012YC: LED Yellow 1C 2A; Part Description: 2.0X1.25mm, SMD Yellow Chip LED Lamp, KPT-2012 Series; PressFit: No; Bonding: No; Part Number: LED_KINGBRIGHT_KPT-2012YC; Component Kind: Standard; Component Type: Standard; Color: Yellow; PackageDescription: SMT Yellow LED, Case 2012, Body L 2.00mm X  W 1.25mm X H 0.75mm; Manufacturer: KINGBRIGHT; Manufacturer Part Number: KPT-2012YC; Pin Count: 2; Case: 0805; Mounted: Yes; Socket: No; SMD: Yes; Sense: No; ComponentHeight: 0.75mm; HelpURL: \\cern.ch\dfs\Applications\Altium\Datasheets\LED_KINGBRIGHT_KPT-2012YC.pdf; Author: CERN DEM JMW; CreateDate: 24.08.2021; LatestRevisionDate: 24.08.2021
VD3 = LED_KINGBRIGHT_KP-2012LSGC: LED Green 1C 2A; Part Description: 2.0x1.2mm Surface Mount Green LED; PressFit: No; Bonding: No; Part Number: LED_KINGBRIGHT_KP-2012LSGC; Component Kind: Standard; Component Type: Standard; Color: Green; PackageDescription: 2.0x1.2mm Surface Mount Green LED; Manufacturer: KINGBRIGHT; Manufacturer Part Number: KP-2012LSGC; Pin Count: 2; Case: 0805; Mounted: Yes; Socket: No; SMD: Yes; Sense: No; ComponentHeight: 1.1mm; HelpURL: \\cern.ch\dfs\Applications\Altium\Datasheets\LED_KINGBRIGHT_KP-2012LSGC.pdf; Author: CERN DEM BC; CreateDate: 09.11.2020; LatestRevisionDate: 09.11.2020
VD7 = LED_KINGBRIGHT_KPT-2012SURCK: LED Red 1C 2A; Part Description: 2.0X1.25mm, SMD Hyper Red Chip LED Lamp, KPT-2012 Series; PressFit: No; Bonding: No; Part Number: LED_KINGBRIGHT_KPT-2012SURCK; Component Kind: Standard; Component Type: Standard; Color: Red; PackageDescription: SMT Hyper Red LED, Case 2012, Body L 2.00mm X  W 1.25mm X H 0.75mm; Manufacturer: KINGBRIGHT; Manufacturer Part Number: KPT-2012SURCK; Pin Count: 2; Case: 0805; Mounted: Yes; Socket: No; SMD: Yes; Sense: No; ComponentHeight: 0.75mm; HelpURL: \\cern.ch\dfs\Applications\Altium\Datasheets\LED_KINGBRIGHT_KPT-2012SURCK.pdf; Author: CERN DEM BC; CreateDate: 06.11.2020; LatestRevisionDate: 06.11.2020
X14 = CONNFLY_DS1013-40SSIB1-B-0: as X11 on sheet FPGA_E; Part Number: CONNFLY_DS1013-40SSIB1-B-0; Component Kind: Standard; Component Type: Standard; Pin Count: 40; Mounted: Yes; Socket: No; SMD: No; Sense: No; Status: None; Manufacturer: CONNFLY; Manufacturer Part Number: DS1013-40SSIB1-B-0; ComponentHeight: 9.1mm; HelpURL: \\cern.ch\dfs\Applications\Altium\Datasheets\CONNFLY_DS1013.pdf; Author: CERN DEM HF; CreateDate: 30.05.2024; LatestRevisionDate: 30.05.2024